# Altium project Analizador_de_espectro.PrjPcb
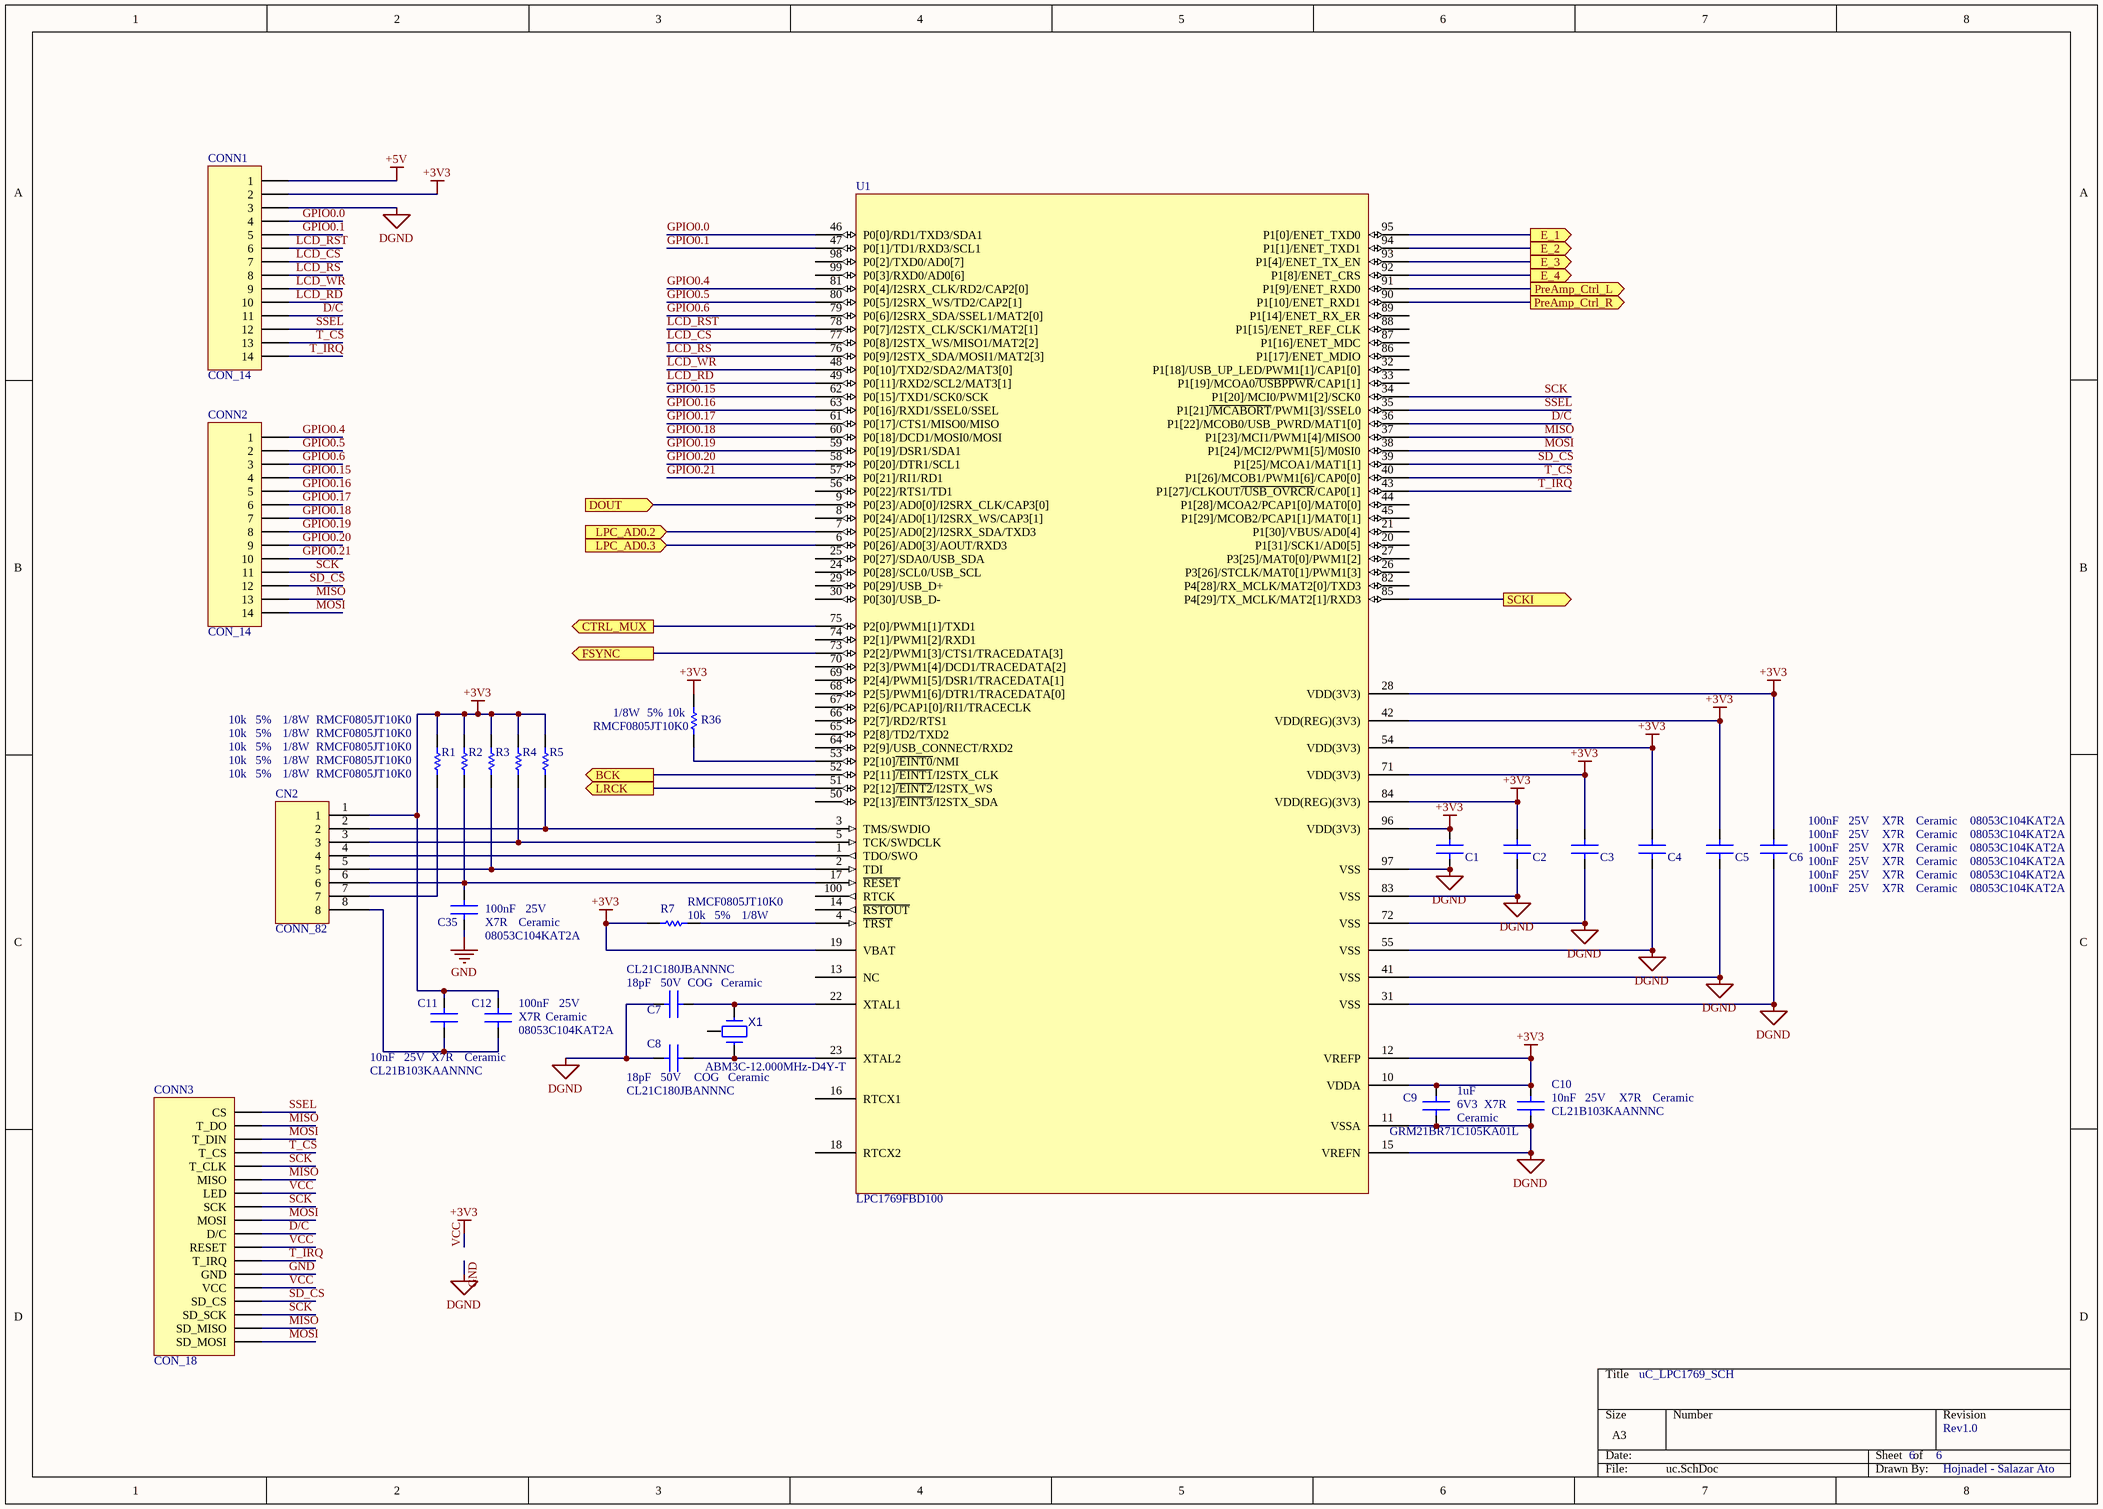
[diagram p0: uc.SchDoc]
3 sheets, 80 parts. Net scope: flat (ports and power ports of the same name join across sheets).
Board file: Analizador_de_espectro.PcbDoc
Sheets:
  uc.SchDoc
  Fuente.SchDoc
  Signal_imputs.SchDoc

## Sheet uc.SchDoc: uC_LPC1769_SCH
size A3; DrawnBy: Hojnadel - Salazar Ato; Revision: Rev1.0; SheetNumber: 6; SheetTotal: 6

### Parts
C1  C: 100nF  V: 25V  Part Number: 08053C104KAT2A  Temp Coef: X7R  Material: Ceramic  [C_0805]  (hidden comment: 100nF 25V X7R Ceramic)
C2  C: 100nF  V: 25V  Part Number: 08053C104KAT2A  Temp Coef: X7R  Material: Ceramic  [C_0805]  (hidden comment: 100nF 25V X7R Ceramic)
C3  C: 100nF  V: 25V  Part Number: 08053C104KAT2A  Temp Coef: X7R  Material: Ceramic  [C_0805]  (hidden comment: 100nF 25V X7R Ceramic)
C4  C: 100nF  V: 25V  Part Number: 08053C104KAT2A  Temp Coef: X7R  Material: Ceramic  [C_0805]  (hidden comment: 100nF 25V X7R Ceramic)
C5  C: 100nF  V: 25V  Part Number: 08053C104KAT2A  Temp Coef: X7R  Material: Ceramic  [C_0805]  (hidden comment: 100nF 25V X7R Ceramic)
C6  C: 100nF  V: 25V  Part Number: 08053C104KAT2A  Temp Coef: X7R  Material: Ceramic  [C_0805]  (hidden comment: 100nF 25V X7R Ceramic)
C7  C: 18pF  V: 50V  Part Number: CL21C180JBANNNC  Temp Coef: COG  Material: Ceramic  [C_0805]  (hidden comment: 18pF 50V COG Ceramic)
C8  C: 18pF  V: 50V  Part Number: CL21C180JBANNNC  Temp Coef: COG  Material: Ceramic  [C_0805]  (hidden comment: 18pF 50V COG Ceramic)
C9  C: 1uF  V: 6V3  Part Number: GRM21BR71C105KA01L  Temp Coef: X7R  Material: Ceramic  [C_0805]  (hidden comment: 1uF 6V3 X7R Ceramic)
C10  C: 10nF  V: 25V  Part Number: CL21B103KAANNNC  Temp Coef: X7R  Material: Ceramic  [C_0805]  (hidden comment: 10nF 25V X7R Ceramic)
C11  C: 10nF  V: 25V  Part Number: CL21B103KAANNNC  Temp Coef: X7R  Material: Ceramic  [C_0805]  (hidden comment: 10nF 25V X7R Ceramic)
C12  C: 100nF  V: 25V  Part Number: 08053C104KAT2A  Temp Coef: X7R  Material: Ceramic  [C_0805]  (hidden comment: 100nF 25V X7R Ceramic)
C35  C: 100nF  V: 25V  Temp Coef: X7R  Part Number: 08053C104KAT2A  Material: Ceramic  [C_0805]  (hidden comment: 100nF 25V X7R Ceramic)
CN2  CONN_82  [HDR_M_08P_0.1]
CONN1  CON_14  [1x14x2.54 Pin Header TH V]
CONN2  CON_14  [1x14x2.54 Pin Header TH V]
CONN3  CON_18  [2x9x2.54 Pin Header TH V]
R1  value 10k  Power: 1/8W  Part Number: RMCF0805JT10K0  Tolerance: 5%  [R_0805]  (hidden comment: 10k 5% 1/8W)
R2  value 10k  Part Number: RMCF0805JT10K0  Tolerance: 5%  Power: 1/8W  [R_0805]  (hidden comment: 10k 5% 1/8W)
R3  value 10k  Power: 1/8W  Part Number: RMCF0805JT10K0  Tolerance: 5%  [R_0805]  (hidden comment: 10k 5% 1/8W)
R4  value 10k  Power: 1/8W  Part Number: RMCF0805JT10K0  Tolerance: 5%  [R_0805]  (hidden comment: 10k 5% 1/8W)
R5  value 10k  Power: 1/8W  Part Number: RMCF0805JT10K0  Tolerance: 5%  [R_0805]  (hidden comment: 10k 5% 1/8W)
R7  value 10k  Power: 1/8W  Part Number: RMCF0805JT10K0  Tolerance: 5%  [R_0805]  (hidden comment: 10k 5% 1/8W)
R36  value 10k  Power: 1/8W  Part Number: RMCF0805JT10K0  Tolerance: 5%  [R_0805]  (hidden comment: 10k 5% 1/8W)
U1  LPC1769FBD100  [LQFP100]
X1  Part Number: ABM3C-12.000MHz-D4Y-T  [ABMC_XTAL]  (hidden comment: XTAL_HF)

### Ports
BCK (out), CTRL_MUX (out), DOUT (in), E_1 (out), E_2 (out), E_3 (out), E_4 (out), FSYNC (out), LPC_AD0.2 (in), LPC_AD0.3 (in), LRCK (out), PreAmp_Ctrl_L (out), PreAmp_Ctrl_R (out), SCKI (out)

### Nets
+5V: CONN1.1
GND: C1.2 C2.2 C3.2 C4.2 C5.2 C6.2 C7.1 C8.1 C9.2 C10.2 C35.2 CONN1.3 CONN3.13(GND) U1.11(VSSA) U1.15(VREFN) U1.31(VSS) U1.41(VSS) U1.55(VSS) U1.72(VSS) U1.83(VSS) U1.97(VSS)  [also labelled DGND]
VCC: C1.1 C2.1 C3.1 C4.1 C5.1 C6.1 C9.1 C10.1 C11.1 C12.1 CN2.1 CONN1.2 CONN3.7(LED) CONN3.11(RESET) CONN3.14(VCC) R1.2 R2.2 R3.2 R4.2 R5.2 R7.2 R36.2 U1.10(VDDA) U1.12(VREFP) U1.19(VBAT) U1.28(VDD(3V3)) U1.42(VDD(REG)(3V3)) U1.54(VDD(3V3)) U1.71(VDD(3V3)) U1.84(VDD(REG)(3V3)) U1.96(VDD(3V3))  [also labelled +3V3]
CTRL_MUX: U1.75(P2[0]/PWM1[1]/TXD1) ; port CTRL_MUX
D/C: CONN1.11 CONN3.10(D/C) U1.36(P1[22]/MCOB0/USB_PWRD/MAT1[0])
GPIO0.0: CONN1.4 U1.46(P0[0]/RD1/TXD3/SDA1)
GPIO0.1: CONN1.5 U1.47(P0[1]/TD1/RXD3/SCL1)
GPIO0.4: CONN2.1 U1.81(P0[4]/I2SRX_CLK/RD2/CAP2[0])
GPIO0.5: CONN2.2 U1.80(P0[5]/I2SRX_WS/TD2/CAP2[1])
GPIO0.6: CONN2.3 U1.79(P0[6]/I2SRX_SDA/SSEL1/MAT2[0])
GPIO0.15: CONN2.4 U1.62(P0[15]/TXD1/SCK0/SCK)
GPIO0.16: CONN2.5 U1.63(P0[16]/RXD1/SSEL0/SSEL)
GPIO0.17: CONN2.6 U1.61(P0[17]/CTS1/MISO0/MISO)
GPIO0.18: CONN2.7 U1.60(P0[18]/DCD1/MOSI0/MOSI)
GPIO0.19: CONN2.8 U1.59(P0[19]/DSR1/SDA1)
GPIO0.20: CONN2.9 U1.58(P0[20]/DTR1/SCL1)
GPIO0.21: CONN2.10 U1.57(P0[21]/RI1/RD1)
LCD_CS: CONN1.7 U1.77(P0[8]/I2STX_WS/MISO1/MAT2[2])
LCD_RD: CONN1.10 U1.49(P0[11]/RXD2/SCL2/MAT3[1])
LCD_RS: CONN1.8 U1.76(P0[9]/I2STX_SDA/MOSI1/MAT2[3])
LCD_RST: CONN1.6 U1.78(P0[7]/I2STX_CLK/SCK1/MAT2[1])
LCD_WR: CONN1.9 U1.48(P0[10]/TXD2/SDA2/MAT3[0])
MISO: CONN2.13 CONN3.2(T_DO) CONN3.6(MISO) CONN3.17(SD_MISO) U1.37(P1[23]/MCI1/PWM1[4]/MISO0)
MOSI: CONN2.14 CONN3.3(T_DIN) CONN3.9(MOSI) CONN3.18(SD_MOSI) U1.38(P1[24]/MCI2/PWM1[5]/M0SI0)
SCK: CONN2.11 CONN3.5(T_CLK) CONN3.8(SCK) CONN3.16(SD_SCK) U1.34(P1[20]/MCI0/PWM1[2]/SCK0)
SD_CS: CONN2.12 CONN3.15(SD_CS) U1.39(P1[25]/MCOA1/MAT1[1])
SSEL: CONN1.12 CONN3.1(CS) U1.35(P1[21]~{/MCABORT}/PWM1[3]/SSEL0)
T_CS: CONN1.13 CONN3.4(T_CS) U1.40(P1[26]/MCOB1/PWM1[6]/CAP0[0])
T_IRQ: CONN1.14 CONN3.12(T_IRQ) U1.43(P1[27]/CLKOUT~{/USB_OVRCR}/CAP0[1])
NetC7_2: C7.2 U1.22(XTAL1) X1.1
NetC8_2: C8.2 U1.23(XTAL2) X1.3
NetC11_2: C11.2 C12.2 CN2.8
NetC35_1: C35.1 CN2.6 R2.1 U1.17(~{RESET})
NetCN2_2: CN2.2 R5.1 U1.3(TMS/SWDIO)
NetCN2_3: CN2.3 R4.1 U1.5(TCK/SWDCLK)
NetCN2_4: CN2.4 U1.1(TDO/SWO)
NetCN2_5: CN2.5 R3.1 U1.2(TDI)
NetCN2_7: CN2.7 R1.1
NetR7_1: R7.1 U1.4(~{TRST})
NetR36_1: R36.1 U1.53(P2[10]~{/EINT0}/NMI)
NetU1_6: U1.6(P0[26]/AD0[3]/AOUT/RXD3) ; port LPC_AD0.3
NetU1_7: U1.7(P0[25]/AD0[2]/I2SRX_SDA/TXD3) ; port LPC_AD0.2
NetU1_9: U1.9(P0[23]/AD0[0]/I2SRX_CLK/CAP3[0]) ; port DOUT
NetU1_51: U1.51(P2[12]~{/EINT2}/I2STX_WS) ; port LRCK
NetU1_52: U1.52(P2[11]~{/EINT1}/I2STX_CLK) ; port BCK
NetU1_73: U1.73(P2[2]/PWM1[3]/CTS1/TRACEDATA[3]) ; port FSYNC
NetU1_85: U1.85(P4[29]/TX_MCLK/MAT2[1]/RXD3) ; port SCKI
NetU1_90: U1.90(P1[10]/ENET_RXD1) ; port PreAmp_Ctrl_R
NetU1_91: U1.91(P1[9]/ENET_RXD0) ; port PreAmp_Ctrl_L
NetU1_92: U1.92(P1[8]/ENET_CRS) ; port E_4
NetU1_93: U1.93(P1[4]/ENET_TX_EN) ; port E_3
NetU1_94: U1.94(P1[1]/ENET_TXD1) ; port E_2
NetU1_95: U1.95(P1[0]/ENET_TXD0) ; port E_1
NetX1_2: X1.2(GND) X1.4

Not connected (* = marked no-connect by the designer): U1 8(P0[24]/AD0[1]/I2SRX_WS/CAP3[1]) 13(NC) 14(~{RSTOUT}) 16(RTCX1) 18(RTCX2) 20(P1[31]/SCK1/AD0[5]) 21(P1[30]/VBUS/AD0[4]) 24(P0[28]/SCL0/USB_SCL) 25(P0[27]/SDA0/USB_SDA) 26(P3[26]/STCLK/MAT0[1]/PWM1[3]) 27(P3[25]/MAT0[0]/PWM1[2]) 29(P0[29]/USB_D+) 30(P0[30]/USB_D-) 32(P1[18]/USB_UP_LED/PWM1[1]/CAP1[0]) 33(P1[19]/MCOA0~{/USBPPWR}/CAP1[1]) 44(P1[28]/MCOA2/PCAP1[0]/MAT0[0]) 45(P1[29]/MCOB2/PCAP1[1]/MAT0[1]) 50(P2[13]~{/EINT3}/I2STX_SDA) 56(P0[22]/RTS1/TD1) 64(P2[9]/USB_CONNECT/RXD2) 65(P2[8]/TD2/TXD2) 66(P2[7]/RD2/RTS1) 67(P2[6]/PCAP1[0]/RI1/TRACECLK) 68(P2[5]/PWM1[6]/DTR1/TRACEDATA[0]) 69(P2[4]/PWM1[5]/DSR1/TRACEDATA[1]) 70(P2[3]/PWM1[4]/DCD1/TRACEDATA[2]) 74(P2[1]/PWM1[2]/RXD1) 82(P4[28]/RX_MCLK/MAT2[0]/TXD3) 86(P1[17]/ENET_MDIO) 87(P1[16]/ENET_MDC) 88(P1[15]/ENET_REF_CLK) 89(P1[14]/ENET_RX_ER) 98(P0[2]/TXD0/AD0[7]) 99(P0[3]/RXD0/AD0[6]) 100(RTCK)

### Library data of the parts
C1-C12 C35 = Cap1: Capacitor
CONN1 CONN2 = CON_14: CONN TFT 3.5
CONN3 = CON_18: CON_TFT_2.8
R1-R5 R7 R36 = Res1: Resistor
U1 = LPC1768FBD100: CPU Cortex M3; Part Number: LPC1769FBD100
X1 = XTAL_HF: Crystal

## Sheet Fuente.SchDoc: Fuente_SCH
size A4; Author: Hojnadel - Salazar Ato; Revision: Rev1.0; SheetNumber: 2; SheetTotal: 6
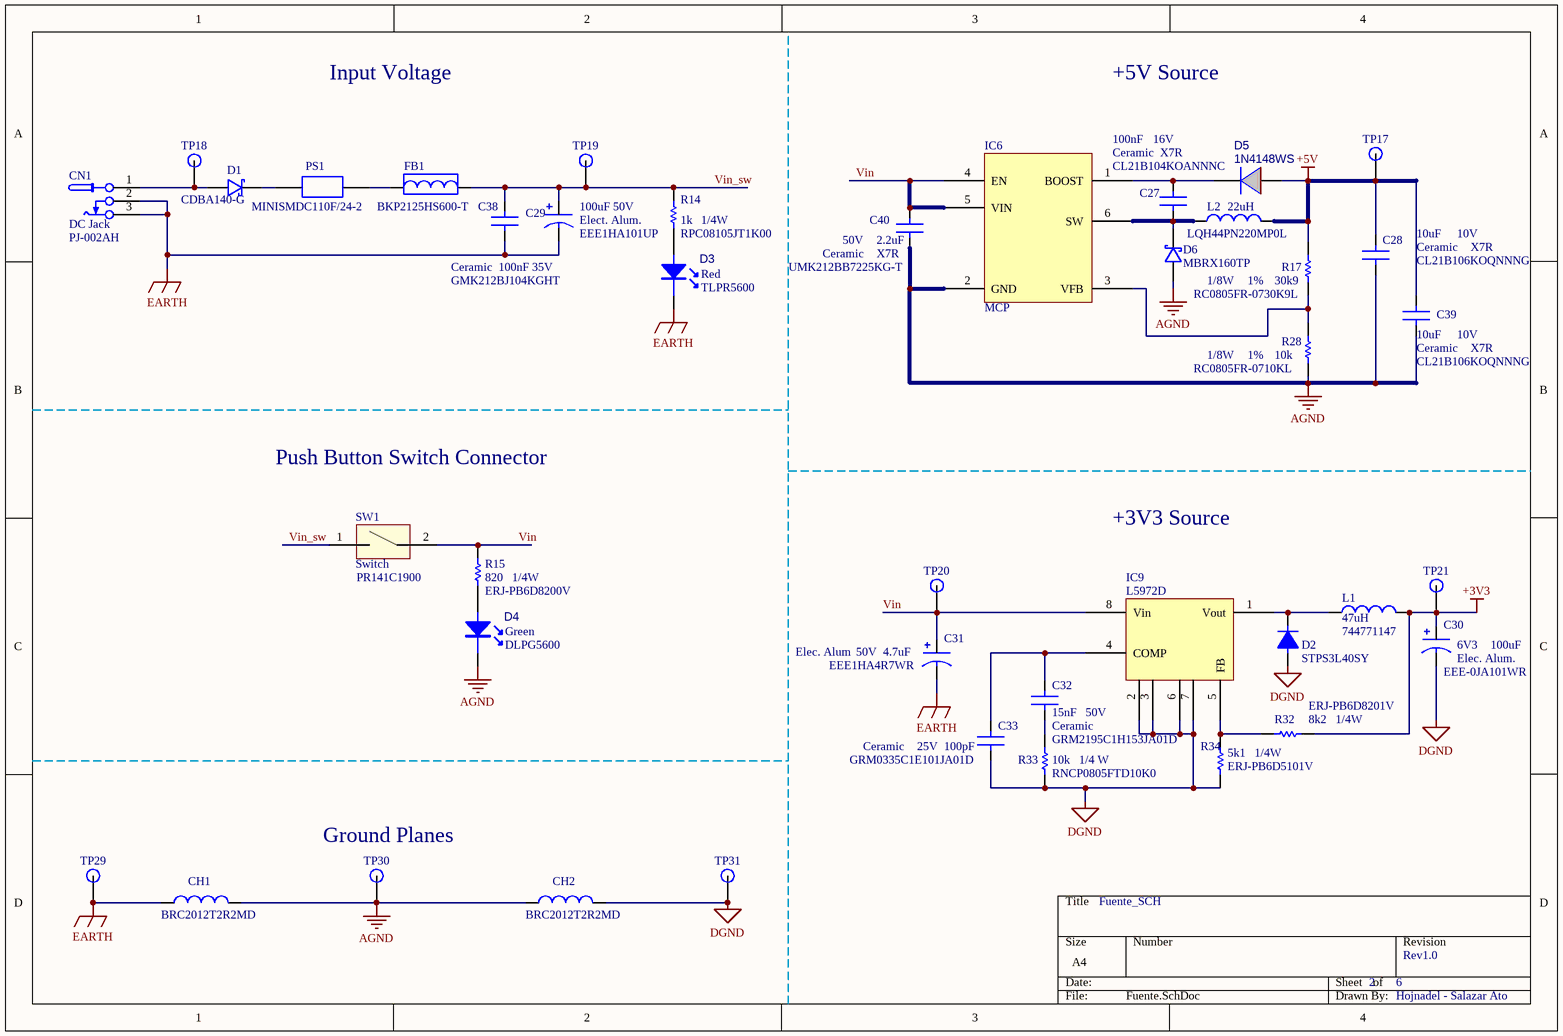
[diagram p1: Fuente.SchDoc]

### Parts
C27  C: 100nF  V: 16V  Part Number: CL21B104KOANNNC  Material: Ceramic  Coef. Term.: X7R  [C_0805]  (hidden comment: 100nF 16V X7R)
C28  C: 10uF  V: 10V  Part Number: CL21B106KOQNNNG  Material: Ceramic  Coef. Term.: X7R  [C_0805]  (hidden comment: 10uF 10V X7R)
C29  C: 100uF  V: 50V  Material: Elect. Alum.  Part number: EEE1HA101UP  [C_AE10083X105M]  (hidden comment: 100uF 50V ElecAlum)
C30  C: 100uF  V: 6V3  Material: Elec. Alum.  Part number: EEE-0JA101WR  [C_AE6553X54M]  (hidden comment: 100uF 6V3 ElecAlum)
C31  C: 4.7uF  V: 50V  Material: Elec. Alum  Part number: EEE1HA4R7WR  [C_AE6553X54M]  (hidden comment: 4.7uF 50V ElecAlum)
C32  C: 15nF  V: 50V  Part Number: GRM2195C1H153JA01D  Material: Ceramic  [C_0805]  (hidden comment: 15nF 50V Ceramic)
C33  C: 100pF  V: 25V  Part Number: GRM0335C1E101JA01D  Material: Ceramic  [C_0805]  (hidden comment: 100pF 25V Ceramic)
C38  C: 100nF  V: 35V  Part Number: GMK212BJ104KGHT  Material: Ceramic  [C_0805]  (hidden comment: 100nF 35V Ceramic)
C39  C: 10uF  V: 10V  Part Number: CL21B106KOQNNNG  Material: Ceramic  Coef. Term.: X7R  [C_0805]  (hidden comment: 10uF 10V X7R)
C40  C: 2.2uF  V: 50V  Part Number: UMK212BB7225KG-T  Material: Ceramic  Temp. Coef.: X7R  [C_0805]  (hidden comment: 2.2uF 50V X7R)
CH1  Part Number: BRC2012T2R2MD  [I_CHOQUE_DFN]  (hidden comment: Choke)
CH2  Part Number: BRC2012T2R2MD  [I_CHOQUE_DFN]  (hidden comment: Choke)
CN1  DC Jack  Part Number: PJ-002AH  [Jack_PJ002A]
D1  CDBA140-G  [D_DO-214AC_Schottky]
D2  Part Number: STPS3L40SY  [D_M6959X25N]  (hidden comment: STPS3L40)
D3  Color: Red  Part Number: TLPR5600  [Led_TH]  (hidden comment: LED)
D4  Part Number: DLPG5600  Color: Green  [Led_TH]  (hidden comment: LED)
D5  1N4148WS  [1N4148WS]
D6  MBRX160TP  [SOD_123]
FB1  Part Number: BKP2125HS600-T  [Ferrite_bead]  (hidden comment: Ferrite Bead)
IC6  MCP  [SOT23_6P]
IC9  L5972D  [SO8]
L1  Part Number: 744771147  [I_P128122X60N]  (hidden comment: 47uH)
L2  LQH44PN220MP0L  value 22uH  [VLCF5028]
PS1  Part Number: MINISMDC110F/24-2  [POLISWITCH_1]  (hidden comment: Polyswitch)
R14  value 1k  Potencia: 1/4W  Part Number: RPC08105JT1K00  [R_0805]  (hidden comment: Res1)
R15  value 820  Potencia: 1/4W  Part Number: ERJ-PB6D8200V  [R_0805]  (hidden comment: Res1)
R17  value 30k9  Tolerance: 1%  Power: 1/8W  Part Number: RC0805FR-0730K9L  [R_0805]  (hidden comment: 30k9 1%)
R28  value 10k  Tolerance: 1%  Power: 1/8W  Part Number: RC0805FR-0710KL  [R_0805]  (hidden comment: 30k9 1%)
R32  value 8k2  Part Number: ERJ-PB6D8201V  Power: 1/4W  [R_0805]  (hidden comment: 8k2 1/4W)
R33  value 10k  Part Number: RNCP0805FTD10K0  Power: 1/4 W  [R_0805]  (hidden comment: 10k 1/4W)
R34  value 5k1  Part Number: ERJ-PB6D5101V  Power: 1/4W  [R_0805]  (hidden comment: 5k1 1/4W)
SW1  Switch  Part Number: PR141C1900  [BORNERA_2X5MM]
TP17  TP  [TP]  (value not drawn)
TP18  TP  [TP]  (value not drawn)
TP19  TP  [TP]  (value not drawn)
TP20  TP  [TP]  (value not drawn)
TP21  TP  [TP]  (value not drawn)
TP29  TP  [TP]  (value not drawn)
TP30  TP  [TP]  (value not drawn)
TP31  TP  [TP]  (value not drawn)

### Nets
+3V3: C30.1 L1.2 R32.1 TP21.1  [project net VCC]
+5V: C28.1 C39.1 D5.1(A) L2.2 R17.2 TP17.1
AGND: C28.2 C39.2 C40.2 CH1.2 CH2.1 D4.2 D6.1(A) IC6.2(GND) R28.1 TP30.1
DGND: C30.2 C33.2 CH2.2 D2.1 IC9.2(GND) IC9.3(GND) IC9.6(GND) IC9.7(GND) R33.1 R34.1 TP31.1  [project net GND]
EARTH: C29.2 C31.2 C38.2 CH1.1 CN1.2 CN1.3 D3.2 TP29.1
Vin: C31.1 C40.1 IC6.4(EN) IC6.5(VIN) IC9.8(Vin) R15.2 SW1.2 TP20.1
Vin_sw: C29.1 C38.1 FB1.2 R14.1 SW1.1 TP19.1
NetC27_1: C27.1 D5.2(K) IC6.1(BOOST)
NetC27_2: C27.2 D6.2(K) IC6.6(SW) L2.1
NetC32_1: C32.1 C33.1 IC9.4(COMP)
NetC32_2: C32.2 R33.2
NetCN1_1: CN1.1 D1.1(A) TP18.1
NetD1_2: D1.2(K) PS1.1
NetD2_2: D2.2 IC9.1(Vout) L1.1
NetD3_1: D3.1 R14.2
NetD4_1: D4.1 R15.1
NetFB1_1: FB1.1 PS1.2
NetIC6_3: IC6.3(VFB) R17.1 R28.2
NetIC9_5: IC9.5(FB) R32.2 R34.2

### Notes on the sheet
- Input Voltage
- +5V Source
- Push Button Switch Connector
- +3V3 Source
- (near TP30) Ground Planes

### Library data of the parts
C27 C28 C32 C33 C38-C40 = Cap1: Capacitor
C29-C31 = Cap_Elec: Capacitor
CN1 = Barrel_jack: Connector
D1 = Diodo_Schottky: Diodo Schottky; Part Number: CDBA140-G
D2 = DIODO: Diode
D5 = DIODO: Diode signal; Part Number: 1N4148WS
D6 = Diodo_Schottky: Part Number: MBRX160TP
IC6 = Sw Source: Switching Source; Part Number: *
IC9 = L5972D: Fuente Switching; Part Number: L5972D013TR
L1 L2 = Inductor: Code_IEC: 1005; Published: 8-Jun-2000; LatestRevisionDate: 29-May-2009; LatestRevisionNote: IPC-7351 Footprint Added.; PackageReference: 0402-A; Publisher: Altium Limited; PackageDescription: Chip Inductor; Code_JEITA: 0402
  L1: Value: 47uH
PS1 = Poliswitch: Polishwitch
R14 R17 R28 R32-R34 = Res1: Resistor
R15 = Res1: Resistor; Tolerance: 5%
SW1 = SW
TP17-TP21 TP29-TP31 = Test Point

## Sheet Signal_imputs.SchDoc: Signal_Imputs_SCH
size A4; Author: Hojnadel - Salazar, Ato; Revision: Rev1.0; SheetNumber: 3; SheetTotal: 6
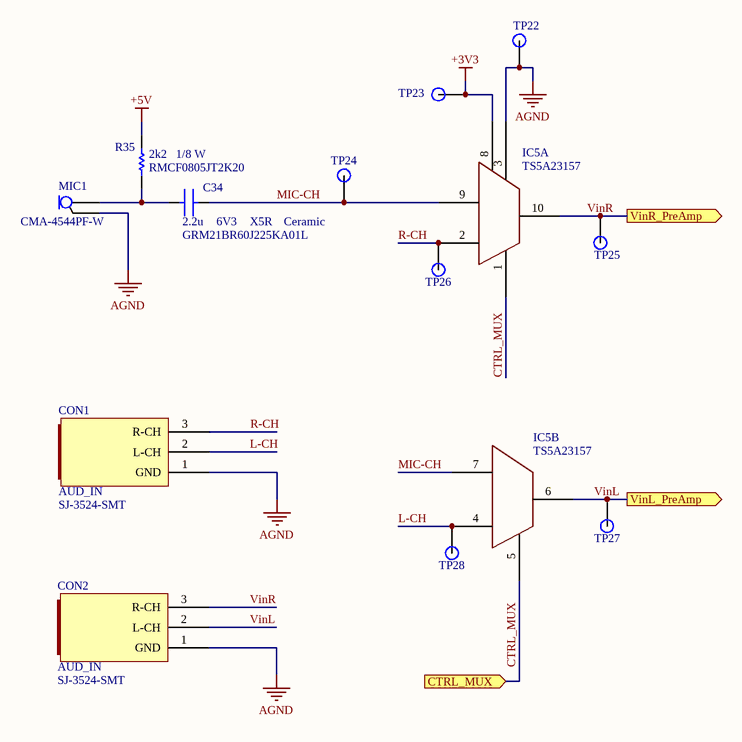
[diagram p2: Signal_imputs.SchDoc]

### Parts
C34  C: 2.2u  V: 6V3  Temp Coef: X5R  Part Number: GRM21BR60J225KA01L  Material: Ceramic  [C_0805]  (hidden comment: 2.2u 6V3 X5R Ceramic)
CON1  AUD_IN  Part Number: SJ-3524-SMT  [AUDIO_JACK 3.5mm SMD]
CON2  AUD_IN  Part Number: SJ-3524-SMT  [AUDIO_JACK 3.5mm SMD]
IC5  TS5A23157  [TSSOP50P490X110-10N]  (parts A,B of 2)
MIC1  Part Number: CMA-4544PF-W  [MIC_CMA-4544PF-W]  (hidden comment: Mic)
R35  value 2k2  Part Number: RMCF0805JT2K20  Power: 1/8 W  [R_0805]  (hidden comment: 2k2 1/8W)
TP22  TP  [TP]  (value not drawn)
TP23  TP  [TP]  (value not drawn)
TP24  TP  [TP]  (value not drawn)
TP25  TP  [TP]  (value not drawn)
TP26  TP  [TP]  (value not drawn)
TP27  TP  [TP]  (value not drawn)
TP28  TP  [TP]  (value not drawn)

### Ports
CTRL_MUX (in), VinL_PreAmp (out), VinR_PreAmp (out)

### Nets
+3V3: IC5.8(VDD) TP23.1  [project net VCC]
+5V: R35.2
AGND: CON1.1(GND) CON2.1(GND) IC5.3(DGND) MIC1.2 TP22.1
CTRL_MUX: IC5.1(IN1) IC5.5(IN2) ; port CTRL_MUX
L-CH: CON1.2(L-CH) IC5.4(NO2) TP28.1
MIC-CH: C34.2 IC5.7(NC2) IC5.9(NC1) TP24.1
R-CH: CON1.3(R-CH) IC5.2(NO1) TP26.1
VinL: CON2.2(L-CH) IC5.6(COM2) TP27.1 ; port VinL_PreAmp
VinR: CON2.3(R-CH) IC5.10(COM1) TP25.1 ; port VinR_PreAmp
NetC34_1: C34.1 MIC1.1 R35.1

### Library data of the parts
C34 = Cap1: Capacitor
CON1 CON2 = Jack_1
IC5 = A_SW_2x2:1_VSSOP: Analog Switch; Part Number: TS5A23157
MIC1 = Mic: Microfono
R35 = Res1: Resistor
TP22-TP28 = Test Point

## Nets that join several sheets
+5V: uc (CONN1.1), Fuente (6 pins), Signal_imputs (R35.2)
AGND: Fuente (10 pins), Signal_imputs (5 pins)
GND: uc (21 pins), Fuente (11 pins)
VCC: uc (31 pins), Fuente (C30.1 L1.2 R32.1 TP21.1), Signal_imputs (IC5.8 TP23.1)
CTRL_MUX: uc (U1.75), Signal_imputs (IC5.1 IC5.5)